# Altium project CustomPFD.PrjPcb
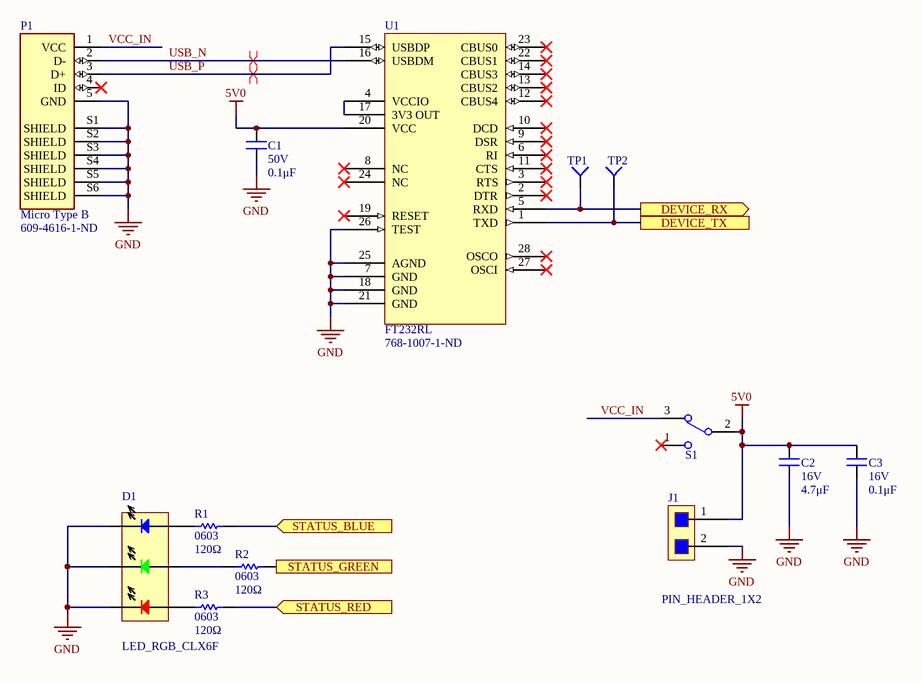
[diagram p0: USB and Power.SchDoc]
5 sheets, 87 parts. Net scope: flat (ports and power ports of the same name join across sheets).
Board file: Board.PcbDoc
Sheets:
  USB and Power.SchDoc
  Controller.SchDoc
  Sensors.SchDoc
  Display Alt.SchDoc
  Coordination.SchDoc

## Sheet USB and Power.SchDoc
size A; SheetNumber: 1; SheetTotal: 5

### Parts
C1  value 0.1μF  Voltage Rating: 50V  [CAP0603]  (hidden comment: CAP_0.1uF_50V_0603)
C2  value 4.7μF  Voltage Rating: 16V  [CAP0603]  (hidden comment: CAP_4.7uF_16V_0603)
C3  value 0.1μF  Voltage Rating: 16V  [CAP0603]  (hidden comment: CAP_0.1uF_16V_0603)
D1  LED_RGB_CLX6F  [SOJ100P350X290-6N]
J1  PIN_HEADER_1X2  [PIN_HEADER - 1X2]
P1  Micro Type B  Supplier Part Number 1: 609-4616-1-ND  [FCI_10118193-0001LF]
R1  value 120Ω  Package/Footprint: 0603  [RES0603]  (hidden comment: RES_120Ω_0603)
R2  value 120Ω  Package/Footprint: 0603  [RES0603]  (hidden comment: RES_120Ω_0603)
R3  value 120Ω  Package/Footprint: 0603  [RES0603]  (hidden comment: RES_120Ω_0603)
S1  SW_TOGGLE_SPDT  [100SP1T1B4M2QE]  (value not drawn)
TP1  TESTPT  [TESTPT SQUARE]  (value not drawn)
TP2  TESTPT  [TESTPT SQUARE]  (value not drawn)
U1  FT232RL  Supplier Part Number 1: 768-1007-1-ND  [FT232RL]

### Ports
DEVICE_RX (out), DEVICE_TX, STATUS_BLUE (in), STATUS_GREEN (in), STATUS_RED (in)

### Nets
5V0: C1.2 C2.2 C3.2 J1.1 S1.2 U1.20(VCC)
GND: C1.1 C2.1 C3.1 D1.1(BLUE_-) D1.2(GREEN_-) D1.3(RED_-) J1.2 P1.5(GND) P1.S1(SHIELD) P1.S2(SHIELD) P1.S3(SHIELD) P1.S4(SHIELD) P1.S5(SHIELD) P1.S6(SHIELD) U1.7(GND) U1.18(GND) U1.21(GND) U1.25(AGND) U1.26(TEST)
USB_N: P1.2(D-) U1.16(USBDM)
USB_P: P1.3(D+) U1.15(USBDP)
VCC_IN: P1.1(VCC) S1.3
NetD1_4: D1.4(Red_+) R3.1
NetD1_5: D1.5(Green_+) R2.1
NetD1_6: D1.6(Blue_+) R1.1
NetR1_2: R1.2 ; port STATUS_BLUE
NetR2_2: R2.2 ; port STATUS_GREEN
NetR3_2: R3.2 ; port STATUS_RED
NetTP1_1: TP1.1(=value) U1.5(RXD) ; port DEVICE_RX
NetTP2_1: TP2.1(=value) U1.1(TXD) ; port DEVICE_TX
NetU1_4: U1.4(VCCIO) U1.17(3V3_OUT)

Not connected (* = marked no-connect by the designer): P1 4(ID)*; S1 1*; U1 2(DTR)* 3(RTS)* 6(RI)* 8(NC)* 9(DSR)* 10(DCD)* 11(CTS)* 12(CBUS4)* 13(CBUS2)* 14(CBUS3)* 19(RESET)* 22(CBUS1)* 23(CBUS0)* 24(NC)* 27(OSCI)* 28(OSCO)*

### Layout directives
differential pair: USB_N, USB_P

### Library data of the parts
C1 = CAP_0.1uF_50V_0603: CAP CER 0.1UF 50V X7R 0603; Manufacturer Part Number 1: CC0603KRX7R9BB104; Manufacturer 1: Yageo; Package/Footprint: 0603; Supplier Part Number 1: 311-1344-1-ND; Supplier 1: Digi-Key; Mounting Type: SMD; Dielectric: X7R
C2 = CAP_4.7uF_16V_0603: CAP CER 4.7UF 16V X6S 0603; Manufacturer Part Number 1: GRM188C81C475KE11D; Manufacturer 1: Murata Electronics; Package/Footprint: 0603; Supplier Part Number 1: 490-13362-1-ND; Supplier 1: Digi-Key; Mounting Type: SMD; Dielectric: X6S
C3 = CAP_0.1uF_16V_0603: CAP CER 0.1UF 16V X7R 0603; Manufacturer Part Number 1: CC0603KRX7R7BB104; Manufacturer 1: Yageo; Package/Footprint: 0603; Supplier Part Number 1: 311-1088-1-ND; Supplier 1: Digi-Key; Dielectric: X7R
D1 = LED_RGB_CLX6F: Visible LED; Manufacturer: Cree; MP: CLX6F-FKC-CKNNQDGBB7A363; MF: Cree Inc.; Optoelectronic Device Type: TRIPLE COLOR LED; Value: *; SnapEDA_Link: https://www.snapeda.com/parts/CLX6F-FKC-CKNNQDGBB7A363/Cree%20Inc./view-part/641291/?ref=snap; Package: PLCC-6 Cree; Digi-Key_Part_Number: CLX6F-FKC-CKNNQDGBB7A363CT-ND; Digi-Key_Purchase_URL: https://www.digikey.de/product-detail/en/cree-inc/CLX6F-FKC-CKNNQDGBB7A363/CLX6F-FKC-CKNNQDGBB7A363CT-ND/9452642?utm_source=snapeda&utm_medium=aggregator&utm_campaign=symbol; Supplier 1: Digi-Key; Manufacturer Part Number: CLX6F-FKC-CKNNQDGBB7A363; RoHS: Yes; Category: LEDs; Stock 1: 37409; Pricing 1: 1=0.30000, 10=0.27900, 100=0.25800, 1000=0.23077 (USD); REACH SVHC: No SVHC; RoHS Compliant: Yes; ComponentLink1URL: https://datasheet.ciiva.com:443/pdfs/VipMasterIC/IC/CREE/CREE-S-A0009778122/CREE-S-A0009831345-1.pdf?src-supplier=IHS+Markit; ComponentLink1Description: https://datasheet.ciiva.com:443/pdfs/VipMasterIC/IC/CREE/CREE-S-A0009778122/CREE-S-A0009831345-1.pdf?src-supplier=IHS+Markit; ComponentLink2URL: http://www.farnell.com/datasheets/2813756.pdf?src-supplier=Farnell; ComponentLink2Description: http://www.farnell.com/datasheets/2813756.pdf?src-supplier=Farnell; ComponentLink3URL: http://www.mouser.com/ds/2/90/CLX6F-FKC-1352-1064258.pdf?src-supplier=Mouser; ComponentLink3Description: http://www.mouser.com/ds/2/90/CLX6F-FKC-1352-1064258.pdf?src-supplier=Mouser; ComponentLink4URL: http://www.farnell.com/datasheets/2813756.pdf?src-supplier=Element14; ComponentLink4Description: http://www.farnell.com/datasheets/2813756.pdf?src-supplier=Element14; ComponentLink5URL: http://www.farnell.com/datasheets/2813756.pdf?src-supplier=Newark; ComponentLink5Description: http://www.farnell.com/datasheets/2813756.pdf?src-supplier=Newark; ComponentLink6URL: https://www.cree.com/led-components/media/documents/CLX6F-FKC-1352.pdf?src-supplier=Digi-Key; ComponentLink6Description: https://www.cree.com/led-components/media/documents/CLX6F-FKC-1352.pdf?src-supplier=Digi-Key; Supplier Part Number 1: CLX6F-FKC-CKNNQDGBB7A363CT-ND
J1 = PIN_HEADER_1X2: Board Connector, 1 Contact(s), 1 Row(s), Male, Straight, Solder Terminal; Manufacturer: Sullins; Manufacturer Part Number: PREC001SAAN-RC; Option: General Purpose; Filter Feature: No; Number of Rows Loaded: 1; Supplier 1: Digi-Key; RoHS: Yes; Category: Connectors; Stock 1: 16681; Pricing 1: 1=0.04000, 10=0.03000, 25=0.02800, 50=0.02080, 100=0.01780, 250=0.01724, 500=0.01486 (USD); Mount: Board; Connector Type: BOARD CONNECTOR; Contact Gender: Male; Mixed Contacts: No; Mounting Style: STRAIGHT; Termination: Solder; Number of Contacts: 1; Flammability Rating: UL94 V-0; DIN Conformance: No; IEC Conformance: No; MIL Conformance: No; ComponentLink1URL: https://datasheet.ciiva.com:443/pdfs/VipMasterIC/IC/SUCS/SUCS-S-A0005121173/SUCS-S-A0005121173-1.pdf?src-supplier=IHS+Markit; ComponentLink1Description: https://datasheet.ciiva.com:443/pdfs/VipMasterIC/IC/SUCS/SUCS-S-A0005121173/SUCS-S-A0005121173-1.pdf?src-supplier=IHS+Markit; ComponentLink2URL: https://datasheet.ciiva.com/740/zrzczzzszzn-rc-st-11635-b-740844.pdf?src-supplier=Digi-Key; ComponentLink2Description: https://datasheet.ciiva.com/740/zrzczzzszzn-rc-st-11635-b-740844.pdf?src-supplier=Digi-Key; Supplier Part Number 1: S1012EC-01-ND
P1 = USB Connector: USB Connector, 5 Contact(s), Female, Right Angle, Solder Terminal, Locking, Receptacle; Manufacturer: Amphenol FCI; Manufacturer Part Number: 10118193-0001LF; Manufacturer Series: 10118193; Contact Resistance: 30mR; Durability: 10000Cycles; Empty Shell: No; Insertion Force-Max: 35.1392N; Insulation Resistance: 1GR; Mating Information: MULTIPLE MATING PARTS AVAILABLE; Number Of Connectors: 1; PCB Contact Pattern: RECTANGULAR; Polarization Key: POLAR PIN POSITION; Rated Current (Signal): 1.8A; Number of Contacts: 5; Connector Type: TELECOM AND DATACOM CONNECTOR; Option: General Purpose; Board Mounting Option: LOCATING POSTS; Plating Thickness: 30uin; Body Breadth: 0.122inch; Body Depth: 0.199inch; Body Length: 0.309inch; Reference Standard: UL; Reliability: COMMERCIAL; Supplier 1: Digi-Key; RoHS: Yes; Category: USB Connectors; Stock 1: 43659; Pricing 1: 1=0.45000, 10=0.43000, 25=0.36840, 50=0.31320, 100=0.30090, 250=0.27016, 500=0.25788 (USD); ComponentLink1URL: https://datasheet.ciiva.com:443/pdfs/VipMasterIC/IC/FRCI/FRCI-S-A0000088532/FRCI-S-A0001133856-1.pdf?src-supplier=IHS+Markit; ComponentLink1Description: https://datasheet.ciiva.com:443/pdfs/VipMasterIC/IC/FRCI/FRCI-S-A0000088532/FRCI-S-A0001133856-1.pdf?src-supplier=IHS+Markit; Mount: Board; Insulation Material: Polymer; Shell Finish: Tin; Shell Material: Stainless Steel; Contact Material: Copper Alloy; Contact Finish - Mating: GOLD (30) OVER NICKEL; Contact Finish - Termination: GOLD FLASH OVER NICKEL; Contact Gender: Female; Contact Style: USB; Filter Feature: No; Mixed Contacts: No; Mounting Style: RIGHT ANGLE; Number Of PCB Rows: 1; Termination: Solder; JESD-609 Code: e4; Body/Shell Style: RECEPTACLE; Mounting Option 1: LOCKING; Terminal Pitch: 0.6604mm; Flammability Rating: UL94 V-0; DIN Conformance: No; IEC Conformance: No; MIL Conformance: No; ComponentLink2URL: https://datasheet.ciiva.com/851/10118193-851106.pdf?src-supplier=Digi-Key; ComponentLink2Description: https://datasheet.ciiva.com/851/10118193-851106.pdf?src-supplier=Digi-Key; ComponentLink3URL: https://datasheet.ciiva.com/26853/getdatasheetpartid-418618-26853893.pdf?src-supplier=Verical; ComponentLink3Description: https://datasheet.ciiva.com/26853/getdatasheetpartid-418618-26853893.pdf?src-supplier=Verical; ComponentLink4URL: https://datasheet.ciiva.com/4598/10118193ac-197151-4598799.pdf?src-supplier=Mouser; ComponentLink4Description: https://datasheet.ciiva.com/4598/10118193ac-197151-4598799.pdf?src-supplier=Mouser; ComponentLink5URL: https://datasheet.ciiva.com/14802/10118193-0001lf-webpage-14802386.pdf?src-supplier=Arrow+Electronics; ComponentLink5Description: https://datasheet.ciiva.com/14802/10118193-0001lf-webpage-14802386.pdf?src-supplier=Arrow+Electronics; ComponentLink6URL: https://datasheet.ciiva.com/851/10118193-851107.pdf?src-supplier=Digi-Key; ComponentLink6Description: https://datasheet.ciiva.com/851/10118193-851107.pdf?src-supplier=Digi-Key; ComponentLink7URL: https://datasheet.ciiva.com/851/10118193-851108.pdf?src-supplier=Digi-Key; ComponentLink7Description: https://datasheet.ciiva.com/851/10118193-851108.pdf?src-supplier=Digi-Key; ComponentLink8URL: https://datasheet.ciiva.com/14618/70236827-14618887.pdf?src-supplier=Allied+Electronics; ComponentLink8Description: https://datasheet.ciiva.com/14618/70236827-14618887.pdf?src-supplier=Allied+Electronics
R1-R3 = RES_120Ω_0603_5%: RES 120 OHM 5% 1/10W 0603; Manufacturer 1: Yageo; Manufacturer Part Number 1: RC0603JR-07120RL; Supplier Part Number 1: 311-120GRCT-ND; Supplier 1: Digi-Key; Mounting Type: SMD
S1 = SW_TOGGLE_SPDT: SWITCH TOGGLE SPDT 5A 120V; Manufacturer 1: E-Switch; Voltage Rating (DC): 28V; Package/Footprint: TH; Supplier 1: Digi-Key; Mounting Type: TH; Throw Configuration: SPDT; Supplier Part Number 1: EG2355-ND; Manufacturer Part Number 1: 100SP1T1B4M2QE
TP1 TP2 = TESTPT SQUARE
U1 = FT232RL: USB Bus Controller, CMOS, PDSO28; Manufacturer: FTDI; Manufacturer Part Number: FT232RL-REEL; Package Body Material: Plastic; Max Frequency: 48MHz; Max Supply Current: 100uA; Max Supply Voltage: 5.25V; Min Supply Voltage: 3.3V; Qualification Status: Not Qualified; Supplier 1: Digi-Key; RoHS: Yes; Category: Interface ICs; Stock 1: 118964; Pricing 1: 1=4.50000, 10=4.05000, 50=3.85000, 100=3.65000, 250=3.25000, 500=2.85002, 1000=2.65000 (USD); Package Code: SSOP; Number of Pins: 28; Package Shape: Rectangular; Min Operating Temperature: -40°C; Max Operating Temperature: 85°C; JESD-30 Code: R-PDSO-G28; Moisture Sensitivity Level: 3; Package Style: SMALL OUTLINE, SHRINK PITCHMeter; Surface Mount: Yes; Technology: CMOS; Terminal Form: Gull Wing; Terminal Position: DUAL; Length: 10.2mm; Width: 5.3mm; Height - Seated (Max): 2mm; Terminal Pitch: 0.65mm; Temperature Grade: INDUSTRIAL; ComponentLink1URL: https://datasheet.ciiva.com:443/pdfs/VipMasterIC/IC/FTDI/FTDI-S-A0007980421/FTDI-S-A0007980421-1.pdf?src-supplier=IHS+Markit; ComponentLink1Description: https://datasheet.ciiva.com:443/pdfs/VipMasterIC/IC/FTDI/FTDI-S-A0007980421/FTDI-S-A0007980421-1.pdf?src-supplier=IHS+Markit; ComponentLink2URL: https://datasheet.ciiva.com/34304/2161019-34304054.pdf?src-supplier=Jameco; ComponentLink2Description: https://datasheet.ciiva.com/34304/2161019-34304054.pdf?src-supplier=Jameco; ComponentLink3URL: https://datasheet.ciiva.com/4787/ds-ft232r-11534-4787658.pdf?src-supplier=Mouser; ComponentLink3Description: https://datasheet.ciiva.com/4787/ds-ft232r-11534-4787658.pdf?src-supplier=Mouser; ComponentLink4URL: https://datasheet.ciiva.com/26841/ft232rl-reel-26841080.pdf?src-supplier=IIIC; ComponentLink4Description: https://datasheet.ciiva.com/26841/ft232rl-reel-26841080.pdf?src-supplier=IIIC; ComponentLink5URL: https://datasheet.ciiva.com/1787/ds-ft232r-1787047.pdf?src-supplier=Digi-Key; ComponentLink5Description: https://datasheet.ciiva.com/1787/ds-ft232r-1787047.pdf?src-supplier=Digi-Key; ComponentLink6URL: https://datasheet.ciiva.com/1787/ds-ft232r-1787048.pdf?src-supplier=Digi-Key; ComponentLink6Description: https://datasheet.ciiva.com/1787/ds-ft232r-1787048.pdf?src-supplier=Digi-Key; ComponentLink7URL: https://datasheet.ciiva.com/1787/ds-ft232r-1787049.pdf?src-supplier=Digi-Key; ComponentLink7Description: https://datasheet.ciiva.com/1787/ds-ft232r-1787049.pdf?src-supplier=Digi-Key; ComponentLink8URL: https://datasheet.ciiva.com/15150/getdatasheetpartid-643207-15150506.pdf?src-supplier=Verical; ComponentLink8Description: https://datasheet.ciiva.com/15150/getdatasheetpartid-643207-15150506.pdf?src-supplier=Verical; ComponentLink9URL: https://datasheet.ciiva.com/16200/ds-ft232r-16200652.pdf?src-supplier=Future+Electronics; ComponentLink9Description: https://datasheet.ciiva.com/16200/ds-ft232r-16200652.pdf?src-supplier=Future+Electronics

## Sheet Controller.SchDoc
size A; SheetNumber: 2; SheetTotal: 5
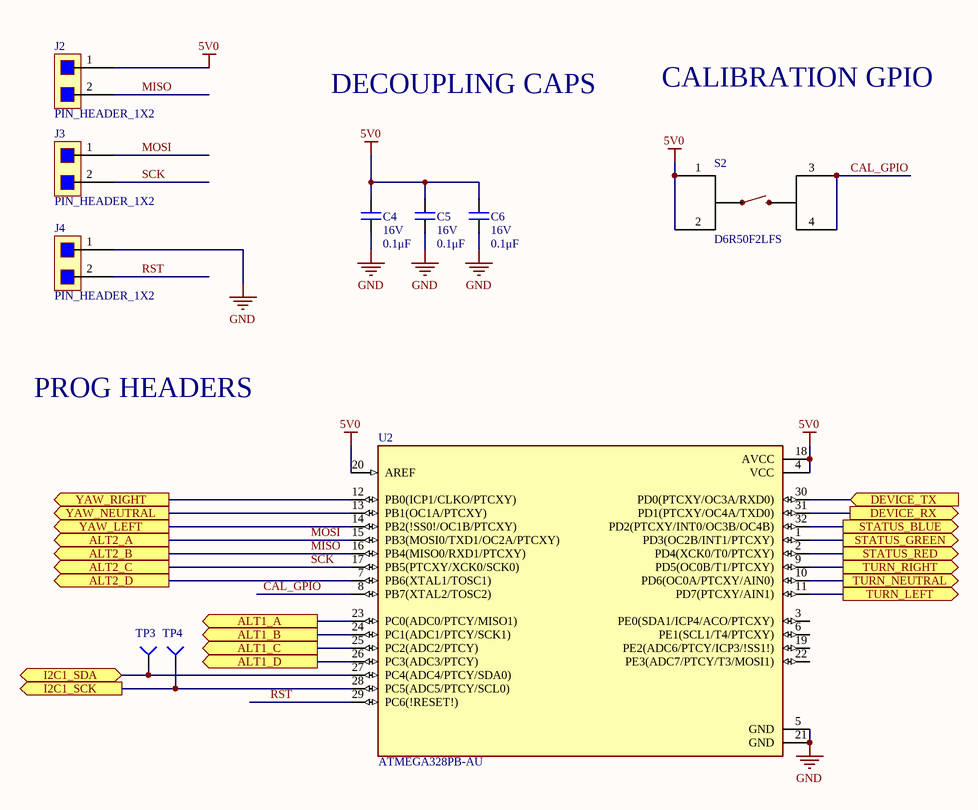
[diagram p1: Controller.SchDoc]

### Parts
C4  value 0.1μF  Voltage Rating: 16V  [CAP0603]  (hidden comment: CAP_0.1uF_16V_0603)
C5  value 0.1μF  Voltage Rating: 16V  [CAP0603]  (hidden comment: CAP_0.1uF_16V_0603)
C6  value 0.1μF  Voltage Rating: 16V  [CAP0603]  (hidden comment: CAP_0.1uF_16V_0603)
J2  PIN_HEADER_1X2  [PIN_HEADER - 1X2]
J3  PIN_HEADER_1X2  [PIN_HEADER - 1X2]
J4  PIN_HEADER_1X2  [PIN_HEADER - 1X2]
S2  Manufacturer Part Number 1: D6R50F2LFS  [D6R]  (hidden comment: SW_MOMENTARY_SPST)
TP3  TESTPT  [TESTPT SQUARE]  (value not drawn)
TP4  TESTPT  [TESTPT SQUARE]  (value not drawn)
U2  ATMEGA328PB-AU  [QFP80P900X900X120-32N]

### Ports
ALT1_A (out), ALT1_B (out), ALT1_C (out), ALT1_D (out), ALT2_A (out), ALT2_B (out), ALT2_C (out), ALT2_D (out), DEVICE_RX (out), DEVICE_TX (in), I2C1_SCK (out), I2C1_SDA (bidir), STATUS_BLUE (out), STATUS_GREEN (out), STATUS_RED (out), TURN_LEFT (out), TURN_NEUTRAL (out), TURN_RIGHT (out), YAW_LEFT (out), YAW_NEUTRAL (out), YAW_RIGHT (out)

### Nets
5V0: C4.2 C5.2 C6.2 J2.1 S2.1 S2.2 U2.4(VCC) U2.18(AVCC) U2.20(AREF)
GND: C4.1 C5.1 C6.1 J4.1 U2.5(GND) U2.21(GND)
CAL_GPIO: S2.3 S2.4 U2.8(PB7(XTAL2/TOSC2))
I2C1_SCK: TP4.1(=value) U2.28(PC5(ADC5/PTCY/SCL0)) ; port I2C1_SCK
I2C1_SDA: TP3.1(=value) U2.27(PC4(ADC4/PTCY/SDA0)) ; port I2C1_SDA
MISO: J2.2 U2.16(PB4(MISO0/RXD1/PTCXY)) ; port ALT2_B
MOSI: J3.1 U2.15(PB3(MOSI0/TXD1/OC2A/PTCXY)) ; port ALT2_A
RST: J4.2 U2.29(PC6(!RESET!))
SCK: J3.2 U2.17(PB5(PTCXY/XCK0/SCK0)) ; port ALT2_C
NetD2_5: U2.9(PD5(OC0B/T1/PTCXY)) ; port TURN_RIGHT
NetD3_5: U2.12(PB0(ICP1/CLKO/PTCXY)) ; port YAW_RIGHT
NetD4_6: U2.10(PD6(OC0A/PTCXY/AIN0)) ; port TURN_NEUTRAL
NetD5_6: U2.13(PB1(OC1A/PTCXY)) ; port YAW_NEUTRAL
NetD6_4: U2.11(PD7(PTCXY/AIN1)) ; port TURN_LEFT
NetD7_4: U2.14(PB2(!SS0!/OC1B/PTCXY)) ; port YAW_LEFT
NetR1_2: U2.32(PD2(PTCXY/INT0/OC3B/OC4B)) ; port STATUS_BLUE
NetR2_2: U2.1(PD3(OC2B/INT1/PTCXY)) ; port STATUS_GREEN
NetR3_2: U2.2(PD4(XCK0/T0/PTCXY)) ; port STATUS_RED
NetTP1_1: U2.31(PD1(PTCXY/OC4A/TXD0)) ; port DEVICE_RX
NetTP2_1: U2.30(PD0(PTCXY/OC3A/RXD0)) ; port DEVICE_TX
NetTP6_1: U2.23(PC0(ADC0/PTCY/MISO1)) ; port ALT1_A
NetTP7_1: U2.24(PC1(ADC1/PTCY/SCK1)) ; port ALT1_B
NetTP8_1: U2.25(PC2(ADC2/PTCY)) ; port ALT1_C
NetTP9_1: U2.26(PC3(ADC3/PTCY)) ; port ALT1_D
NetTP13_1: U2.7(PB6(XTAL1/TOSC1)) ; port ALT2_D

Not connected (* = marked no-connect by the designer): U2 3(PE0(SDA1/ICP4/ACO/PTCXY)) 6(PE1(SCL1/T4/PTCXY)) 19(PE2(ADC6/PTCY/ICP3/!SS1!)) 22(PE3(ADC7/PTCY/T3/MOSI1))

### Notes on the sheet
- DECOUPLING CAPS
- CALIBRATION GPIO
- PROG HEADERS

### Library data of the parts
C4-C6 = CAP_0.1uF_16V_0603: as C3 on sheet USB and Power; Supplier Part Number 1: 311-1088-1-ND; Supplier 1: Digi-Key; Dielectric: X7R
J2-J4 = PIN_HEADER_1X2: as J1 on sheet USB and Power; Supplier 1: Digi-Key; RoHS: Yes; Category: Connectors; Stock 1: 16681; Pricing 1: 1=0.04000, 10=0.03000, 25=0.02800, 50=0.02080, 100=0.01780, 250=0.01724, 500=0.01486 (USD); Mount: Board; Connector Type: BOARD CONNECTOR; Contact Gender: Male; Mixed Contacts: No; Mounting Style: STRAIGHT; Termination: Solder; Number of Contacts: 1; Flammability Rating: UL94 V-0; DIN Conformance: No; IEC Conformance: No; MIL Conformance: No; ComponentLink1URL: https://datasheet.ciiva.com:443/pdfs/VipMasterIC/IC/SUCS/SUCS-S-A0005121173/SUCS-S-A0005121173-1.pdf?src-supplier=IHS+Markit; ComponentLink1Description: https://datasheet.ciiva.com:443/pdfs/VipMasterIC/IC/SUCS/SUCS-S-A0005121173/SUCS-S-A0005121173-1.pdf?src-supplier=IHS+Markit; ComponentLink2URL: https://datasheet.ciiva.com/740/zrzczzzszzn-rc-st-11635-b-740844.pdf?src-supplier=Digi-Key; ComponentLink2Description: https://datasheet.ciiva.com/740/zrzczzzszzn-rc-st-11635-b-740844.pdf?src-supplier=Digi-Key; Supplier Part Number 1: S1012EC-01-ND
S2 = SW_MOMENTARY_SPST: SWITCH PUSH SPST-NO 0.1A 32V; Manufacturer 1: ITT C&K; Current Rating: 100mA; Throw Configuration: SPST; Operating Force: 2.5N; Actuator Type: Round, Button; Switch Function: Off-Mom; Electrical Life: 250000Cycles; Actuator Length: 7mm; Row Spacing: 5mm; Supplier 1: Digi-Key; Contact Plating: Silver; Number of Terminals: 4; Max Voltage Rating (DC): 32V; Voltage Rating (DC): 32V; Max Current Rating: 100mA; Orientation: Straight; Terminal Pitch: 5mm; Supplier Part Number 1: 401-1993-ND
TP3 TP4 = TESTPT SQUARE
U2 = ATMEGA328PB-AU: RISC Microcontroller, 8-Bit, FLASH, AVR RISC CPU, 20MHz, CMOS, PQFP32; Manufacturer: Microchip; MF: Microchip Technology; Digi-Key_Purchase_URL: https://www.digikey.com/product-detail/en/microchip-technology/ATMEGA328PB-AU/ATMEGA328PB-AU-ND/5638812?utm_source=snapeda&utm_medium=aggregator&utm_campaign=symbol; Digi-Key_Part_Number: ATMEGA328PB-AU-ND; MP: ATMEGA328PB-AU; Value: *; SnapEDA_Link: https://www.snapeda.com/parts/ATMEGA328PB-AU/Microchip/view-part/4478285/?ref=snap; Package: TQFP-32 Microchip Technology; Supplier 1: Digi-Key; Manufacturer Part Number: ATMEGA328PB-AU; RoHS: Yes; Category: Microcontrollers; Pricing 1: 1=1.47000, 25=1.35320, 100=1.23200 (USD); Technology: CMOS; REACH SVHC: Yes; RoHS Compliant: Yes; ComponentLink1URL: https://datasheet.ciiva.com:443/pdfs/VipMasterIC/IC/MCHP/MCHP-S-A0004276582/MCHP-S-A0004276582-1.pdf?src-supplier=IHS+Markit; ComponentLink1Description: https://datasheet.ciiva.com:443/pdfs/VipMasterIC/IC/MCHP/MCHP-S-A0004276582/MCHP-S-A0004276582-1.pdf?src-supplier=IHS+Markit; ComponentLink2URL: http://www.farnell.com/datasheets/2915218.pdf?src-supplier=Farnell; ComponentLink2Description: http://www.farnell.com/datasheets/2915218.pdf?src-supplier=Farnell; ComponentLink3URL: http://www.farnell.com/datasheets/2915218.pdf?src-supplier=Newark; ComponentLink3Description: http://www.farnell.com/datasheets/2915218.pdf?src-supplier=Newark; ComponentLink4URL: http://www.microchip.com/mymicrochip/filehandler.aspx?ddocname=en589666&src-supplier=Digi-Key; ComponentLink4Description: http://www.microchip.com/mymicrochip/filehandler.aspx?ddocname=en589666&src-supplier=Digi-Key; Supplier Part Number 1: ATMEGA328PB-AU-ND

## Sheet Sensors.SchDoc
size A; SheetNumber: 3; SheetTotal: 5
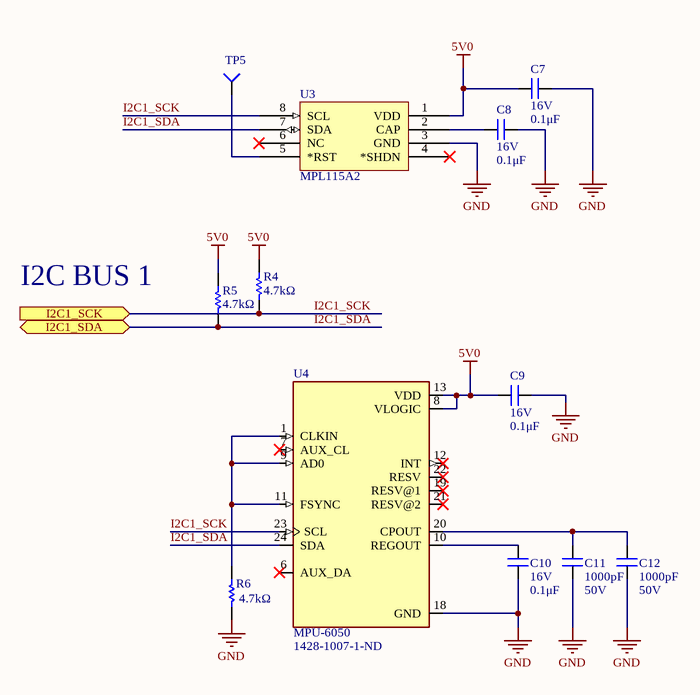
[diagram p2: Sensors.SchDoc]

### Parts
C7  value 0.1μF  Voltage Rating: 16V  [CAP0603]  (hidden comment: CAP_0.1uF_16V_0603)
C8  value 0.1μF  Voltage Rating: 16V  [CAP0603]  (hidden comment: CAP_0.1uF_16V_0603)
C9  value 0.1μF  Voltage Rating: 16V  [CAP0603]  (hidden comment: CAP_0.1uF_16V_0603)
C10  value 0.1μF  Voltage Rating: 16V  [CAP0603]  (hidden comment: CAP_0.1uF_16V_0603)
C11  value 1000pF  Voltage Rating: 50V  [CAP0805]  (hidden comment: CAP_1000pF_50V_0805)
C12  value 1000pF  Voltage Rating: 50V  [CAP0805]  (hidden comment: CAP_1000pF_50V_0805)
R4  value 4.7kΩ  [RES0603]  (hidden comment: RES_4.7kΩ_0603)
R5  value 4.7kΩ  [RES0603]  (hidden comment: RES_4.7kΩ_0603)
R6  value 4.7kΩ  [RES0603]  (hidden comment: RES_4.7kΩ_0603)
TP5  TESTPT  [TESTPT SQUARE]  (value not drawn)
U3  MPL115A2  [LGA8 - MPL115A2]
U4  MPU-6050  Supplier Part Number 1: 1428-1007-1-ND  [QFN50P400X400X95-24N]

### Ports
I2C1_SCK (in), I2C1_SDA (bidir)

### Nets
5V0: C7.2 C9.2 R4.1 R5.1 U3.1(VDD) U4.8(VLOGIC) U4.13(VDD)
GND: C7.1 C8.1 C9.1 C10.1 C11.1 C12.1 R6.2 U3.3(GND) U4.18(GND)
I2C1_SCK: R4.2 U3.8(SCL) U4.23(SCL) ; port I2C1_SCK
I2C1_SDA: R5.2 U3.7(SDA) U4.24(SDA) ; port I2C1_SDA
NetC8_2: C8.2 U3.2(CAP)
NetC10_2: C10.2 U4.10(REGOUT)
NetC11_2: C11.2 C12.2 U4.20(CPOUT)
NetR6_1: R6.1 U4.1(CLKIN) U4.9(AD0) U4.11(FSYNC)
NetTP5_1: TP5.1(=value) U3.5(*RST)

Not connected (* = marked no-connect by the designer): U3 4(*SHDN)* 6(NC)*; U4 6(AUX_DA)* 7(AUX_CL)* 12(INT)* 19(RESV@1)* 21(RESV@2)* 22(RESV)*

### Notes on the sheet
- I2C BUS 1

### Library data of the parts
C7-C10 = CAP_0.1uF_16V_0603: as C3 on sheet USB and Power; Supplier Part Number 1: 311-1088-1-ND; Supplier 1: Digi-Key; Dielectric: X7R
C11 C12 = CAP_1000pF_50V_0805: CAP CER 1000pF 50V X7R 0805; Manufacturer 1: Samsung; Manufacturer Part Number 1: CL21B102KBANNNC; Package/Footprint: 0805; Supplier 1: Digi-Key; Mounting Type: SMD; Supplier Part Number 1: 1276-1020-1-ND; Dielectric: X7R
R4-R6 = RES_4.7kΩ_0603_5%: RES 4.7K OHM 5% 1/10W 0603; Manufacturer 1: Yageo; Manufacturer Part Number 1: RC0603JR-074K7L; Supplier Part Number 1: 311-4.7KGRCT-ND; Supplier 1: Digi-Key
TP5 = TESTPT SQUARE
U3 = MPL115A2: Absolute, 7.25Psi Min, 16.67Psi Max, Rectangular, Surface Mount; Manufacturer: NXP Freescale; MF: NXP USA; Output Type: DIGITAL OUTPUT; Operating Current-Max: 10uA; Output Interface Type: I2C; Port Type: HOLE; Sensors/Transducers Type: PRESSURE SENSOR,PEIZORESISTIVE; Max Supply Voltage: 5.5V; Min Supply Voltage: 2.375V; Body Breadth: 3inch; Body Height: 1.2mm; Body Length or Diameter: 5mm; Availability: Unavailable; SnapEDA_Link: https://www.snapeda.com/parts/MPL115A2/NXP%20USA%20Inc./view-part/494170/?ref=snap; Price: None; MP: MPL115A2; Package: LGA-8 NXP Semiconductors; Value: *; Mouser-Purchase-URL: https://snapeda.com/shop?store=Mouser&id=494170; Supplier 1: Digi-Key; Manufacturer Part Number: MPL115A2; RoHS: Yes; Category: Pressure Sensors; Stock 1: 4480; Pricing 1: 1=7.73000, 5=6.82400, 10=6.02800, 25=5.95800 (USD); Mount: Surface Mount; Package Shape/Style: Rectangular; Min Operating Temperature: -40°C; Max Operating Temperature: 105°C; Pressure Range-Max: 16.67PSI; Pressure Range-Min: 7.25PSI; Pressure Type: Absolute; Termination: Solder; REACH SVHC: Yes; RoHS Compliant: Yes; ComponentLink1URL: https://datasheet.ciiva.com:443/pdfs/VipMasterIC/IC/PHGL/PHGL-S-A0003556458/PHGL-S-A0003556458-1.pdf?src-supplier=IHS+Markit; ComponentLink1Description: https://datasheet.ciiva.com:443/pdfs/VipMasterIC/IC/PHGL/PHGL-S-A0003556458/PHGL-S-A0003556458-1.pdf?src-supplier=IHS+Markit; ComponentLink2URL: https://datasheet.ciiva.com/2843/mpl115a2-2843361.pdf?src-supplier=Digi-Key; ComponentLink2Description: https://datasheet.ciiva.com/2843/mpl115a2-2843361.pdf?src-supplier=Digi-Key; ComponentLink3URL: https://datasheet.ciiva.com/3272/mpl115a2-3272679.pdf?src-supplier=Avnet; ComponentLink3Description: https://datasheet.ciiva.com/3272/mpl115a2-3272679.pdf?src-supplier=Avnet; ComponentLink4URL: https://datasheet.ciiva.com/1578/mpl115a2-1578868.pdf?src-supplier=Farnell; ComponentLink4Description: https://datasheet.ciiva.com/1578/mpl115a2-1578868.pdf?src-supplier=Farnell; ComponentLink5URL: https://datasheet.ciiva.com/26808/getdatasheetpartid-254526-26808246.pdf?src-supplier=Verical; ComponentLink5Description: https://datasheet.ciiva.com/26808/getdatasheetpartid-254526-26808246.pdf?src-supplier=Verical; ComponentLink6URL: https://datasheet.ciiva.com/26023/mpl115a2-26023221.pdf?src-supplier=Avnet+Europe; ComponentLink6Description: https://datasheet.ciiva.com/26023/mpl115a2-26023221.pdf?src-supplier=Avnet+Europe; ComponentLink7URL: https://datasheet.ciiva.com/1513/1789292-1513797.pdf?src-supplier=Element14; ComponentLink7Description: https://datasheet.ciiva.com/1513/1789292-1513797.pdf?src-supplier=Element14; ComponentLink8URL: https://datasheet.ciiva.com/1513/1789292-1513908.pdf?src-supplier=Element14; ComponentLink8Description: https://datasheet.ciiva.com/1513/1789292-1513908.pdf?src-supplier=Element14; Supplier Part Number 1: MPL115A2-ND
U4 = MPU-6050: Analog Circuit, 1 Func, CMOS; MF: TDK InvenSense; Number of Functions: 1; Package Equivalence Code: LCC24,.16SQ,20; Power Supplies: 1.8,2.5/3.3V; Supply Voltage-Max (Vsup): 3.46V; Supply Voltage-Min (Vsup): 2.375V; Supply Voltage-Nom (Vsup): 2.5V; Qualification Status: Not Qualified; Price: None; Package: VFQFN-24 TDK InvenSense; MP: MPU-6050; Value: *; Availability: Unavailable; SnapEDA_Link: https://www.snapeda.com/parts/MPU-6050/TDK%20InvenSense/view-part/4503180/?ref=snap; Supplier 1: Digi-Key; Manufacturer: TDK InvenSense; Manufacturer Part Number: MPU-6050; RoHS: Yes; Category: Inertial Measurement Units (IMUs); Stock 1: 4503; Pricing 1: 1=10.70000, 5=6.95000, 10=6.25500, 25=5.56000, 50=5.14300, 100=4.44800, 500=4.17000, 1000=3.89200 (USD); Package Code: HVQCCN; Number of Pins: 24; Package Shape: Square; Terminal Finish: Nickel; Min Operating Temperature: -40°C; Max Operating Temperature: 85°C; Analog IC - Other Type: ANALOG CIRCUIT; JESD-609 Code: e4; JESD-30 Code: S-XQCC-N24; Package Style: CHIP CARRIER, HEAT SINK/SLUG, VERY THIN PROFILEMeter; Surface Mount: Yes; Technology: CMOS; Terminal Form: No Lead; Terminal Position: QUAD; Moisture Sensitivity Level: 3; Length: 4mm; Width: 4mm; Height - Seated (Max): 0.95mm; Terminal Pitch: 0.5mm; REACH SVHC: No SVHC; RoHS Compliant: Yes; Temperature Grade: INDUSTRIAL; ComponentLink1URL: https://datasheet.ciiva.com:443/pdfs/VipMasterIC/IC/IVNC/IVNCS00058/IVNCS00058-1.pdf?src-supplier=IHS+Markit; ComponentLink1Description: https://datasheet.ciiva.com:443/pdfs/VipMasterIC/IC/IVNC/IVNCS00058/IVNCS00058-1.pdf?src-supplier=IHS+Markit; ComponentLink2URL: https://datasheet.ciiva.com/1513/1788002-1513632.pdf?src-supplier=Element14; ComponentLink2Description: https://datasheet.ciiva.com/1513/1788002-1513632.pdf?src-supplier=Element14; ComponentLink3URL: https://datasheet.ciiva.com/22731/1788002-22731434.pdf?src-supplier=Element14; ComponentLink3Description: https://datasheet.ciiva.com/22731/1788002-22731434.pdf?src-supplier=Element14

## Sheet Display Alt.SchDoc
size A; SheetNumber: 4; SheetTotal: 5
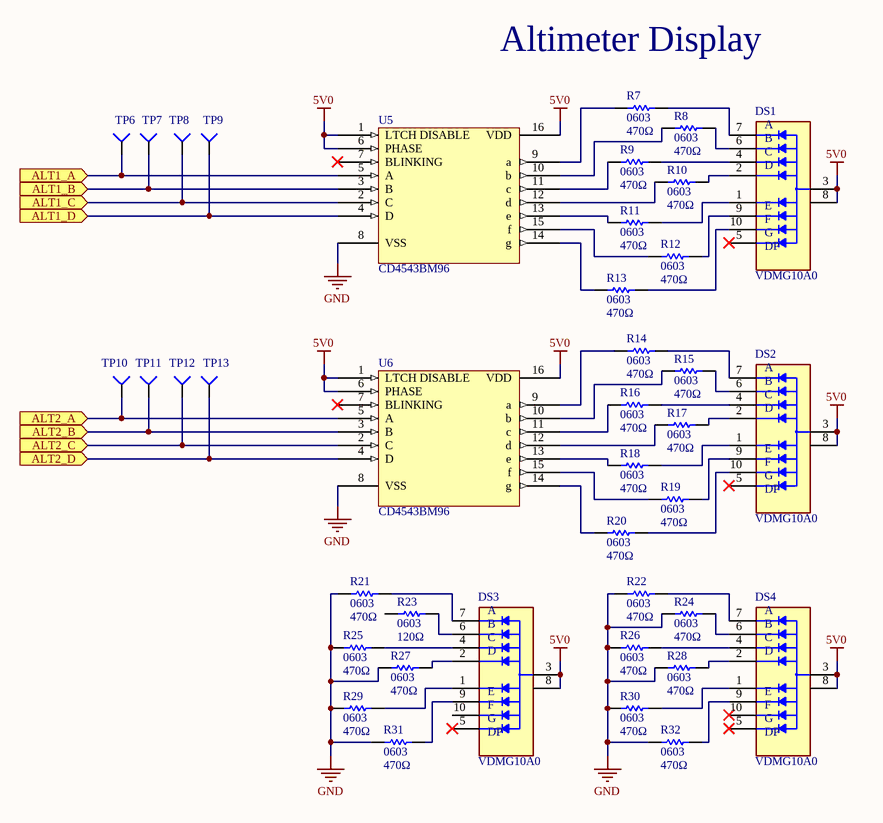
[diagram p3: Display Alt.SchDoc]

### Parts
DS1  VDMG10A0  [DISPLAY_VDMG10A0]
DS2  VDMG10A0  [DISPLAY_VDMG10A0]
DS3  VDMG10A0  [DISPLAY_VDMG10A0]
DS4  VDMG10A0  [DISPLAY_VDMG10A0]
R7  value 470Ω  Footprint Size: 0603  [RES0603]  (hidden comment: 470R 1%)
R8  value 470Ω  Footprint Size: 0603  [RES0603]  (hidden comment: 470R 1%)
R9  value 470Ω  Footprint Size: 0603  [RES0603]  (hidden comment: 470R 1%)
R10  value 470Ω  Footprint Size: 0603  [RES0603]  (hidden comment: 470R 1%)
R11  value 470Ω  Footprint Size: 0603  [RES0603]  (hidden comment: 470R 1%)
R12  value 470Ω  Footprint Size: 0603  [RES0603]  (hidden comment: 470R 1%)
R13  value 470Ω  Footprint Size: 0603  [RES0603]  (hidden comment: 470R 1%)
R14  value 470Ω  Footprint Size: 0603  [RES0603]  (hidden comment: 470R 1%)
R15  value 470Ω  Footprint Size: 0603  [RES0603]  (hidden comment: 470R 1%)
R16  value 470Ω  Footprint Size: 0603  [RES0603]  (hidden comment: 470R 1%)
R17  value 470Ω  Footprint Size: 0603  [RES0603]  (hidden comment: 470R 1%)
R18  value 470Ω  Footprint Size: 0603  [RES0603]  (hidden comment: 470R 1%)
R19  value 470Ω  Footprint Size: 0603  [RES0603]  (hidden comment: 470R 1%)
R20  value 470Ω  Footprint Size: 0603  [RES0603]  (hidden comment: 470R 1%)
R21  value 470Ω  Footprint Size: 0603  [RES0603]  (hidden comment: 470R 1%)
R22  value 470Ω  Footprint Size: 0603  [RES0603]  (hidden comment: 470R 1%)
R23  value 120Ω  Package/Footprint: 0603  [RES0603]  (hidden comment: RES_120Ω_0603)
R24  value 470Ω  Footprint Size: 0603  [RES0603]  (hidden comment: 470R 1%)
R25  value 470Ω  Footprint Size: 0603  [RES0603]  (hidden comment: 470R 1%)
R26  value 470Ω  Footprint Size: 0603  [RES0603]  (hidden comment: 470R 1%)
R27  value 470Ω  Footprint Size: 0603  [RES0603]  (hidden comment: 470R 1%)
R28  value 470Ω  Footprint Size: 0603  [RES0603]  (hidden comment: 470R 1%)
R29  value 470Ω  Footprint Size: 0603  [RES0603]  (hidden comment: 470R 1%)
R30  value 470Ω  Footprint Size: 0603  [RES0603]  (hidden comment: 470R 1%)
R31  value 470Ω  Footprint Size: 0603  [RES0603]  (hidden comment: 470R 1%)
R32  value 470Ω  Footprint Size: 0603  [RES0603]  (hidden comment: 470R 1%)
TP6  TESTPT  [TESTPT SQUARE]  (value not drawn)
TP7  TESTPT  [TESTPT SQUARE]  (value not drawn)
TP8  TESTPT  [TESTPT SQUARE]  (value not drawn)
TP9  TESTPT  [TESTPT SQUARE]  (value not drawn)
TP10  TESTPT  [TESTPT SQUARE]  (value not drawn)
TP11  TESTPT  [TESTPT SQUARE]  (value not drawn)
TP12  TESTPT  [TESTPT SQUARE]  (value not drawn)
TP13  TESTPT  [TESTPT SQUARE]  (value not drawn)
U5  CD4543BM96  [SOIC127P600X175-16N]
U6  CD4543BM96  [SOIC127P600X175-16N]

### Ports
ALT1_A (in), ALT1_B (in), ALT1_C (in), ALT1_D (in), ALT2_A (in), ALT2_B (in), ALT2_C (in), ALT2_D (in)

### Nets
5V0: DS1.3(ANODE) DS1.8(ANODE) DS2.3(ANODE) DS2.8(ANODE) DS3.3(ANODE) DS3.8(ANODE) DS4.3(ANODE) DS4.8(ANODE) U5.1(LTCH_DISABLE) U5.6(PHASE) U5.16(VDD) U6.1(LTCH_DISABLE) U6.6(PHASE) U6.16(VDD)
GND: R21.1 R22.1 R24.1 R25.1 R26.1 R27.1 R28.1 R29.1 R30.1 R31.1 R32.1 U5.8(VSS) U6.8(VSS)
MISO: TP11.1(=value) U6.3(B) ; port ALT2_B
MOSI: TP10.1(=value) U6.5(A) ; port ALT2_A
SCK: TP12.1(=value) U6.2(C) ; port ALT2_C
NetDS1_1: DS1.1(E) R11.2
NetDS1_2: DS1.2(D) R10.2
NetDS1_4: DS1.4(C) R9.2
NetDS1_6: DS1.6(B) R8.2
NetDS1_7: DS1.7(A) R7.2
NetDS1_9: DS1.9(F) R12.2
NetDS1_10: DS1.10(G) R13.2
NetDS2_1: DS2.1(E) R18.2
NetDS2_2: DS2.2(D) R17.2
NetDS2_4: DS2.4(C) R16.2
NetDS2_6: DS2.6(B) R15.2
NetDS2_7: DS2.7(A) R14.2
NetDS2_9: DS2.9(F) R19.2
NetDS2_10: DS2.10(G) R20.2
NetDS3_1: DS3.1(E) R29.2
NetDS3_2: DS3.2(D) R27.2
NetDS3_4: DS3.4(C) R25.2
NetDS3_6: DS3.6(B) R23.2
NetDS3_7: DS3.7(A) R21.2
NetDS3_9: DS3.9(F) R31.2
NetDS4_1: DS4.1(E) R30.2
NetDS4_2: DS4.2(D) R28.2
NetDS4_4: DS4.4(C) R26.2
NetDS4_6: DS4.6(B) R24.2
NetDS4_7: DS4.7(A) R22.2
NetDS4_9: DS4.9(F) R32.2
NetR7_1: R7.1 U5.9(a)
NetR8_1: R8.1 U5.10(b)
NetR9_1: R9.1 U5.11(c)
NetR10_1: R10.1 U5.12(d)
NetR11_1: R11.1 U5.13(e)
NetR12_1: R12.1 U5.15(f)
NetR13_1: R13.1 U5.14(g)
NetR14_1: R14.1 U6.9(a)
NetR15_1: R15.1 U6.10(b)
NetR16_1: R16.1 U6.11(c)
NetR17_1: R17.1 U6.12(d)
NetR18_1: R18.1 U6.13(e)
NetR19_1: R19.1 U6.15(f)
NetR20_1: R20.1 U6.14(g)
NetTP6_1: TP6.1(=value) U5.5(A) ; port ALT1_A
NetTP7_1: TP7.1(=value) U5.3(B) ; port ALT1_B
NetTP8_1: TP8.1(=value) U5.2(C) ; port ALT1_C
NetTP9_1: TP9.1(=value) U5.4(D) ; port ALT1_D
NetTP13_1: TP13.1(=value) U6.4(D) ; port ALT2_D

Not connected (* = marked no-connect by the designer): DS1 5(DP)*; DS2 5(DP)*; DS3 5(DP)* 10(G); DS4 5(DP)* 10(G)*; R23 1; U5 7(BLINKING)*; U6 7(BLINKING)*

### Notes on the sheet
- Altimeter Display

### Library data of the parts
DS1-DS4 = 7 SEG DISPLAY - VDMG10A0: Smart/Normal 7 Seg Numeric LED Display; Manufacturer: Vishay Semiconductors; Package: SMD-10 Vishay; MP: VDMG10A0; Supplier 1: Digi-Key; Manufacturer Part Number: VDMG10A0; RoHS: Yes; Category: LED Displays; Stock 1: 6191; Pricing 1: 1=1.55000, 10=1.38200, 100=1.07760 (USD); Optoelectronic Device Type: SMART/NORMAL 7 SEG NUMERIC LED DISPLAY; REACH SVHC: No SVHC; RoHS Compliant: Yes; ComponentLink1URL: https://datasheet.ciiva.com:443/pdfs/VipMasterIC/IC/VISH/VISH-S-A0001108912/VISH-S-A0001108912-1.pdf?src-supplier=IHS+Markit; ComponentLink1Description: https://datasheet.ciiva.com:443/pdfs/VipMasterIC/IC/VISH/VISH-S-A0001108912/VISH-S-A0001108912-1.pdf?src-supplier=IHS+Markit; ComponentLink2URL: https://datasheet.ciiva.com/24075/vdmx10x0-272413-24075313.pdf?src-supplier=Mouser; ComponentLink2Description: https://datasheet.ciiva.com/24075/vdmx10x0-272413-24075313.pdf?src-supplier=Mouser; ComponentLink3URL: https://datasheet.ciiva.com/23867/vdmx10x0-23867376.pdf?src-supplier=Newark; ComponentLink3Description: https://datasheet.ciiva.com/23867/vdmx10x0-23867376.pdf?src-supplier=Newark; ComponentLink4URL: https://datasheet.ciiva.com/29566/vdmx10x0-29566054.pdf?src-supplier=Digi-Key; ComponentLink4Description: https://datasheet.ciiva.com/29566/vdmx10x0-29566054.pdf?src-supplier=Digi-Key; ComponentLink5URL: https://datasheet.ciiva.com/29566/vdmx10x0-29566055.pdf?src-supplier=Digi-Key; ComponentLink5Description: https://datasheet.ciiva.com/29566/vdmx10x0-29566055.pdf?src-supplier=Digi-Key; ComponentLink6URL: https://datasheet.ciiva.com/29566/vdmx10x0-29566056.pdf?src-supplier=Digi-Key; ComponentLink6Description: https://datasheet.ciiva.com/29566/vdmx10x0-29566056.pdf?src-supplier=Digi-Key; ComponentLink7URL: https://datasheet.ciiva.com/30017/vdmx10x0-30017276.pdf?src-supplier=Avnet; ComponentLink7Description: https://datasheet.ciiva.com/30017/vdmx10x0-30017276.pdf?src-supplier=Avnet; ComponentLink8URL: https://datasheet.ciiva.com/23867/1809851-23867367.pdf?src-supplier=Newark; ComponentLink8Description: https://datasheet.ciiva.com/23867/1809851-23867367.pdf?src-supplier=Newark; ComponentLink9URL: https://datasheet.ciiva.com/22726/1913356-22726255.pdf?src-supplier=Element14; ComponentLink9Description: https://datasheet.ciiva.com/22726/1913356-22726255.pdf?src-supplier=Element14; ComponentLink10URL: https://datasheet.ciiva.com/24208/vdmx10x0-24208888.pdf?src-supplier=Future+Electronics; ComponentLink10Description: https://datasheet.ciiva.com/24208/vdmx10x0-24208888.pdf?src-supplier=Future+Electronics; Supplier Part Number 1: VDMG10A0CT-ND
R7-R22 R24-R32 = RES_470Ω_0603_1%: RES 470 OHM 1% 1/10W 0603; Manufacturer 1: Yageo; Manufacturer Part Number 1: RC0603FR-07470RL; Supplier Part Number 1: 311-470HRCT-ND; Supplier 1: Digi-Key
R23 = RES_120Ω_0603_5%: as R1 on sheet USB and Power; Supplier Part Number 1: 311-120GRCT-ND; Supplier 1: Digi-Key; Mounting Type: SMD
TP6-TP13 = TESTPT SQUARE
U5 U6 = 7 SEG DISPLAY IC: Seven Segment Decoder/Driver, 4000/14000/40000 Series, Configurable Output, CMOS, PDSO16; Manufacturer: Texas Instruments; Package Body Material: Plastic; Input Conditioning: LATCHED; Number of Functions: 1; Propagation Delay (tpd): 1200ns; Supply Voltage-Max (Vsup): 18V; Supply Voltage-Min (Vsup): 3V; Supply Voltage-Nom (Vsup): 5V; Qualification Status: Not Qualified; Supplier 1: Digi-Key; RoHS: Yes; Category: Decoders and Multiplexers; Stock 1: 1242; Pricing 1: 1=0.44000, 10=0.37800, 25=0.35240, 100=0.28200, 250=0.26184, 500=0.22154, 1000=0.17119 (USD); Package Code: SOP; Number of Pins: 16; Package Shape: Rectangular; Terminal Finish: Nickel; Min Operating Temperature: -55°C; Max Operating Temperature: 125°C; JESD-609 Code: e4; Output Polarity: Configurable; JESD-30 Code: R-PDSO-G16; Logic IC Type: SEVEN SEGMENT DECODER/DRIVER; Moisture Sensitivity Level: 1; Package Style: SMALL OUTLINEMeter; Peak Reflow Temperature (Cel): 260°C; Surface Mount: Yes; Technology: CMOS; Terminal Form: Gull Wing; Terminal Position: DUAL; Length: 9.9mm; Width: 3.9mm; Height - Seated (Max): 1.75mm; Terminal Pitch: 1.27mm; Temperature Grade: MILITARY; REACH SVHC: Yes; RoHS Compliant: Yes; ComponentLink1URL: https://www.ti.com:443/lit/ds/symlink/cd4543b.pdf?src-supplier=IHS+Markit; ComponentLink1Description: https://www.ti.com:443/lit/ds/symlink/cd4543b.pdf?src-supplier=IHS+Markit; ComponentLink2URL: https://datasheet.ciiva.com/15092/getdatasheetpartid-635761-15092907.pdf?src-supplier=Verical; ComponentLink2Description: https://datasheet.ciiva.com/15092/getdatasheetpartid-635761-15092907.pdf?src-supplier=Verical; ComponentLink3URL: https://datasheet.ciiva.com/41457/001013540-da-01-en-ic-bcd-7seg-ltch-cd4543bm96-soic-16-tid-41457278.pdf?src-supplier=Conrad; ComponentLink3Description: https://datasheet.ciiva.com/41457/001013540-da-01-en-ic-bcd-7seg-ltch-cd4543bm96-soic-16-tid-41457278.pdf?src-supplier=Conrad; ComponentLink4URL: https://datasheet.ciiva.com/6612/cd4543b-6612264.pdf?src-supplier=Digi-Key; ComponentLink4Description: https://datasheet.ciiva.com/6612/cd4543b-6612264.pdf?src-supplier=Digi-Key; ComponentLink5URL: https://datasheet.ciiva.com/6612/cd4543b-6612265.pdf?src-supplier=Digi-Key; ComponentLink5Description: https://datasheet.ciiva.com/6612/cd4543b-6612265.pdf?src-supplier=Digi-Key; ComponentLink6URL: https://datasheet.ciiva.com/6612/cd4543b-6612267.pdf?src-supplier=Digi-Key; ComponentLink6Description: https://datasheet.ciiva.com/6612/cd4543b-6612267.pdf?src-supplier=Digi-Key; Supplier Part Number 1: 296-31539-1-ND; Manufacturer Part Number: CD4543BM96

## Sheet Coordination.SchDoc
size A; SheetNumber: 5; SheetTotal: 5
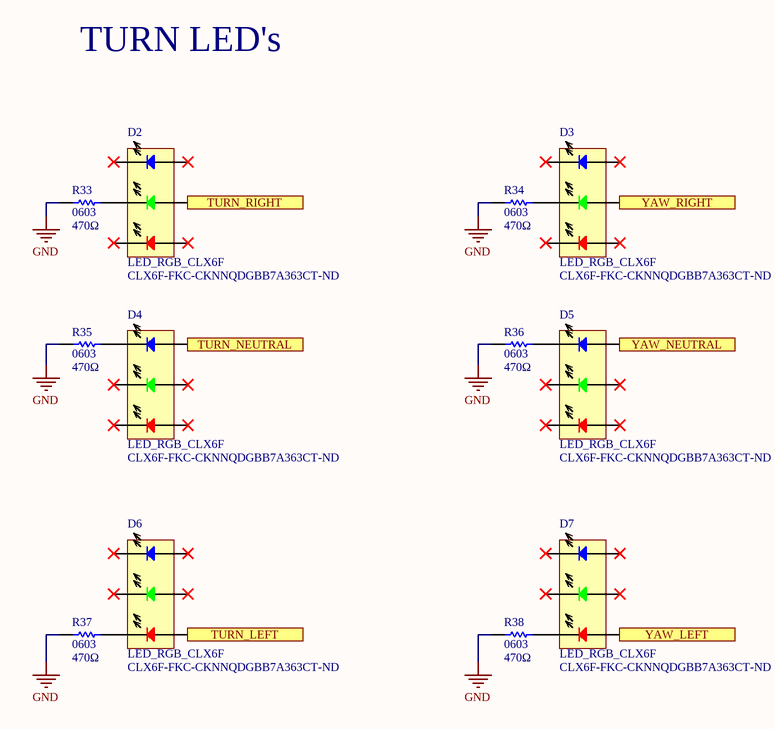
[diagram p4: Coordination.SchDoc]

### Parts
D2  LED_RGB_CLX6F  Supplier Part Number 1: CLX6F-FKC-CKNNQDGBB7A363CT-ND  [SOJ100P350X290-6N]
D3  LED_RGB_CLX6F  Supplier Part Number 1: CLX6F-FKC-CKNNQDGBB7A363CT-ND  [SOJ100P350X290-6N]
D4  LED_RGB_CLX6F  Supplier Part Number 1: CLX6F-FKC-CKNNQDGBB7A363CT-ND  [SOJ100P350X290-6N]
D5  LED_RGB_CLX6F  Supplier Part Number 1: CLX6F-FKC-CKNNQDGBB7A363CT-ND  [SOJ100P350X290-6N]
D6  LED_RGB_CLX6F  Supplier Part Number 1: CLX6F-FKC-CKNNQDGBB7A363CT-ND  [SOJ100P350X290-6N]
D7  LED_RGB_CLX6F  Supplier Part Number 1: CLX6F-FKC-CKNNQDGBB7A363CT-ND  [SOJ100P350X290-6N]
R33  value 470Ω  Footprint Size: 0603  [RES0603]  (hidden comment: 470R 1%)
R34  value 470Ω  Footprint Size: 0603  [RES0603]  (hidden comment: 470R 1%)
R35  value 470Ω  Footprint Size: 0603  [RES0603]  (hidden comment: 470R 1%)
R36  value 470Ω  Footprint Size: 0603  [RES0603]  (hidden comment: 470R 1%)
R37  value 470Ω  Footprint Size: 0603  [RES0603]  (hidden comment: 470R 1%)
R38  value 470Ω  Footprint Size: 0603  [RES0603]  (hidden comment: 470R 1%)

### Ports
TURN_LEFT (in), TURN_NEUTRAL (in), TURN_RIGHT (in), YAW_LEFT (in), YAW_NEUTRAL (in), YAW_RIGHT (in)

### Nets
GND: R33.1 R34.1 R35.1 R36.1 R37.1 R38.1
NetD2_2: D2.2(GREEN_-) R33.2
NetD2_5: D2.5(Green_+) ; port TURN_RIGHT
NetD3_2: D3.2(GREEN_-) R34.2
NetD3_5: D3.5(Green_+) ; port YAW_RIGHT
NetD4_1: D4.1(BLUE_-) R35.2
NetD4_6: D4.6(Blue_+) ; port TURN_NEUTRAL
NetD5_1: D5.1(BLUE_-) R36.2
NetD5_6: D5.6(Blue_+) ; port YAW_NEUTRAL
NetD6_3: D6.3(RED_-) R37.2
NetD6_4: D6.4(Red_+) ; port TURN_LEFT
NetD7_3: D7.3(RED_-) R38.2
NetD7_4: D7.4(Red_+) ; port YAW_LEFT

Not connected (* = marked no-connect by the designer): D2 1(BLUE_-)* 3(RED_-)* 4(Red_+)* 6(Blue_+)*; D3 1(BLUE_-)* 3(RED_-)* 4(Red_+)* 6(Blue_+)*; D4 2(GREEN_-)* 3(RED_-)* 4(Red_+)* 5(Green_+)*; D5 2(GREEN_-)* 3(RED_-)* 4(Red_+)* 5(Green_+)*; D6 1(BLUE_-)* 2(GREEN_-)* 5(Green_+)* 6(Blue_+)*; D7 1(BLUE_-)* 2(GREEN_-)* 5(Green_+)* 6(Blue_+)*

### Notes on the sheet
- TURN LED's

### Library data of the parts
D2-D7 = LED_RGB_CLX6F: as D1 on sheet USB and Power; Value: *; SnapEDA_Link: https://www.snapeda.com/parts/CLX6F-FKC-CKNNQDGBB7A363/Cree%20Inc./view-part/641291/?ref=snap; Package: PLCC-6 Cree; Digi-Key_Part_Number: CLX6F-FKC-CKNNQDGBB7A363CT-ND; Digi-Key_Purchase_URL: https://www.digikey.de/product-detail/en/cree-inc/CLX6F-FKC-CKNNQDGBB7A363/CLX6F-FKC-CKNNQDGBB7A363CT-ND/9452642?utm_source=snapeda&utm_medium=aggregator&utm_campaign=symbol; Supplier 1: Digi-Key; Manufacturer Part Number: CLX6F-FKC-CKNNQDGBB7A363; RoHS: Yes; Category: LEDs; Stock 1: 37409; Pricing 1: 1=0.30000, 10=0.27900, 100=0.25800, 1000=0.23077 (USD); REACH SVHC: No SVHC; RoHS Compliant: Yes; ComponentLink1URL: https://datasheet.ciiva.com:443/pdfs/VipMasterIC/IC/CREE/CREE-S-A0009778122/CREE-S-A0009831345-1.pdf?src-supplier=IHS+Markit; ComponentLink1Description: https://datasheet.ciiva.com:443/pdfs/VipMasterIC/IC/CREE/CREE-S-A0009778122/CREE-S-A0009831345-1.pdf?src-supplier=IHS+Markit; ComponentLink2URL: http://www.farnell.com/datasheets/2813756.pdf?src-supplier=Farnell; ComponentLink2Description: http://www.farnell.com/datasheets/2813756.pdf?src-supplier=Farnell; ComponentLink3URL: http://www.mouser.com/ds/2/90/CLX6F-FKC-1352-1064258.pdf?src-supplier=Mouser; ComponentLink3Description: http://www.mouser.com/ds/2/90/CLX6F-FKC-1352-1064258.pdf?src-supplier=Mouser; ComponentLink4URL: http://www.farnell.com/datasheets/2813756.pdf?src-supplier=Element14; ComponentLink4Description: http://www.farnell.com/datasheets/2813756.pdf?src-supplier=Element14; ComponentLink5URL: http://www.farnell.com/datasheets/2813756.pdf?src-supplier=Newark; ComponentLink5Description: http://www.farnell.com/datasheets/2813756.pdf?src-supplier=Newark; ComponentLink6URL: https://www.cree.com/led-components/media/documents/CLX6F-FKC-1352.pdf?src-supplier=Digi-Key; ComponentLink6Description: https://www.cree.com/led-components/media/documents/CLX6F-FKC-1352.pdf?src-supplier=Digi-Key
R33-R38 = RES_470Ω_0603_1%: as R7 on sheet Display Alt; Supplier Part Number 1: 311-470HRCT-ND; Supplier 1: Digi-Key

## Nets that join several sheets
5V0: USB and Power (6 pins), Controller (9 pins), Sensors (7 pins), Display Alt (14 pins)
GND: USB and Power (19 pins), Controller (6 pins), Sensors (9 pins), Display Alt (13 pins), Coordination (6 pins)
I2C1_SCK: Controller (TP4.1 U2.28), Sensors (R4.2 U3.8 U4.23)
I2C1_SDA: Controller (TP3.1 U2.27), Sensors (R5.2 U3.7 U4.24)
MISO: Controller (J2.2 U2.16), Display Alt (TP11.1 U6.3)
MOSI: Controller (J3.1 U2.15), Display Alt (TP10.1 U6.5)
NetD2_5: Controller (U2.9), Coordination (D2.5)
NetD3_5: Controller (U2.12), Coordination (D3.5)
NetD4_6: Controller (U2.10), Coordination (D4.6)
NetD5_6: Controller (U2.13), Coordination (D5.6)
NetD6_4: Controller (U2.11), Coordination (D6.4)
NetD7_4: Controller (U2.14), Coordination (D7.4)
NetR1_2: USB and Power (R1.2), Controller (U2.32)
NetR2_2: USB and Power (R2.2), Controller (U2.1)
NetR3_2: USB and Power (R3.2), Controller (U2.2)
NetTP1_1: USB and Power (TP1.1 U1.5), Controller (U2.31)
NetTP2_1: USB and Power (TP2.1 U1.1), Controller (U2.30)
NetTP6_1: Controller (U2.23), Display Alt (TP6.1 U5.5)
NetTP7_1: Controller (U2.24), Display Alt (TP7.1 U5.3)
NetTP8_1: Controller (U2.25), Display Alt (TP8.1 U5.2)
NetTP9_1: Controller (U2.26), Display Alt (TP9.1 U5.4)
NetTP13_1: Controller (U2.7), Display Alt (TP13.1 U6.4)
SCK: Controller (J3.2 U2.17), Display Alt (TP12.1 U6.2)